# EasyEDA schematic 1 Schematic_Antenna Mini-Whip (TH).json

## Sheets
1 Antenna Mini-Whip (TH): Main module: TITLE: Antenna Mini-Whip (TH): Main module; REV: 4.7.EE; Date: 2018-05-17; Sheet: 1/2; Drawn By: IgrikXD
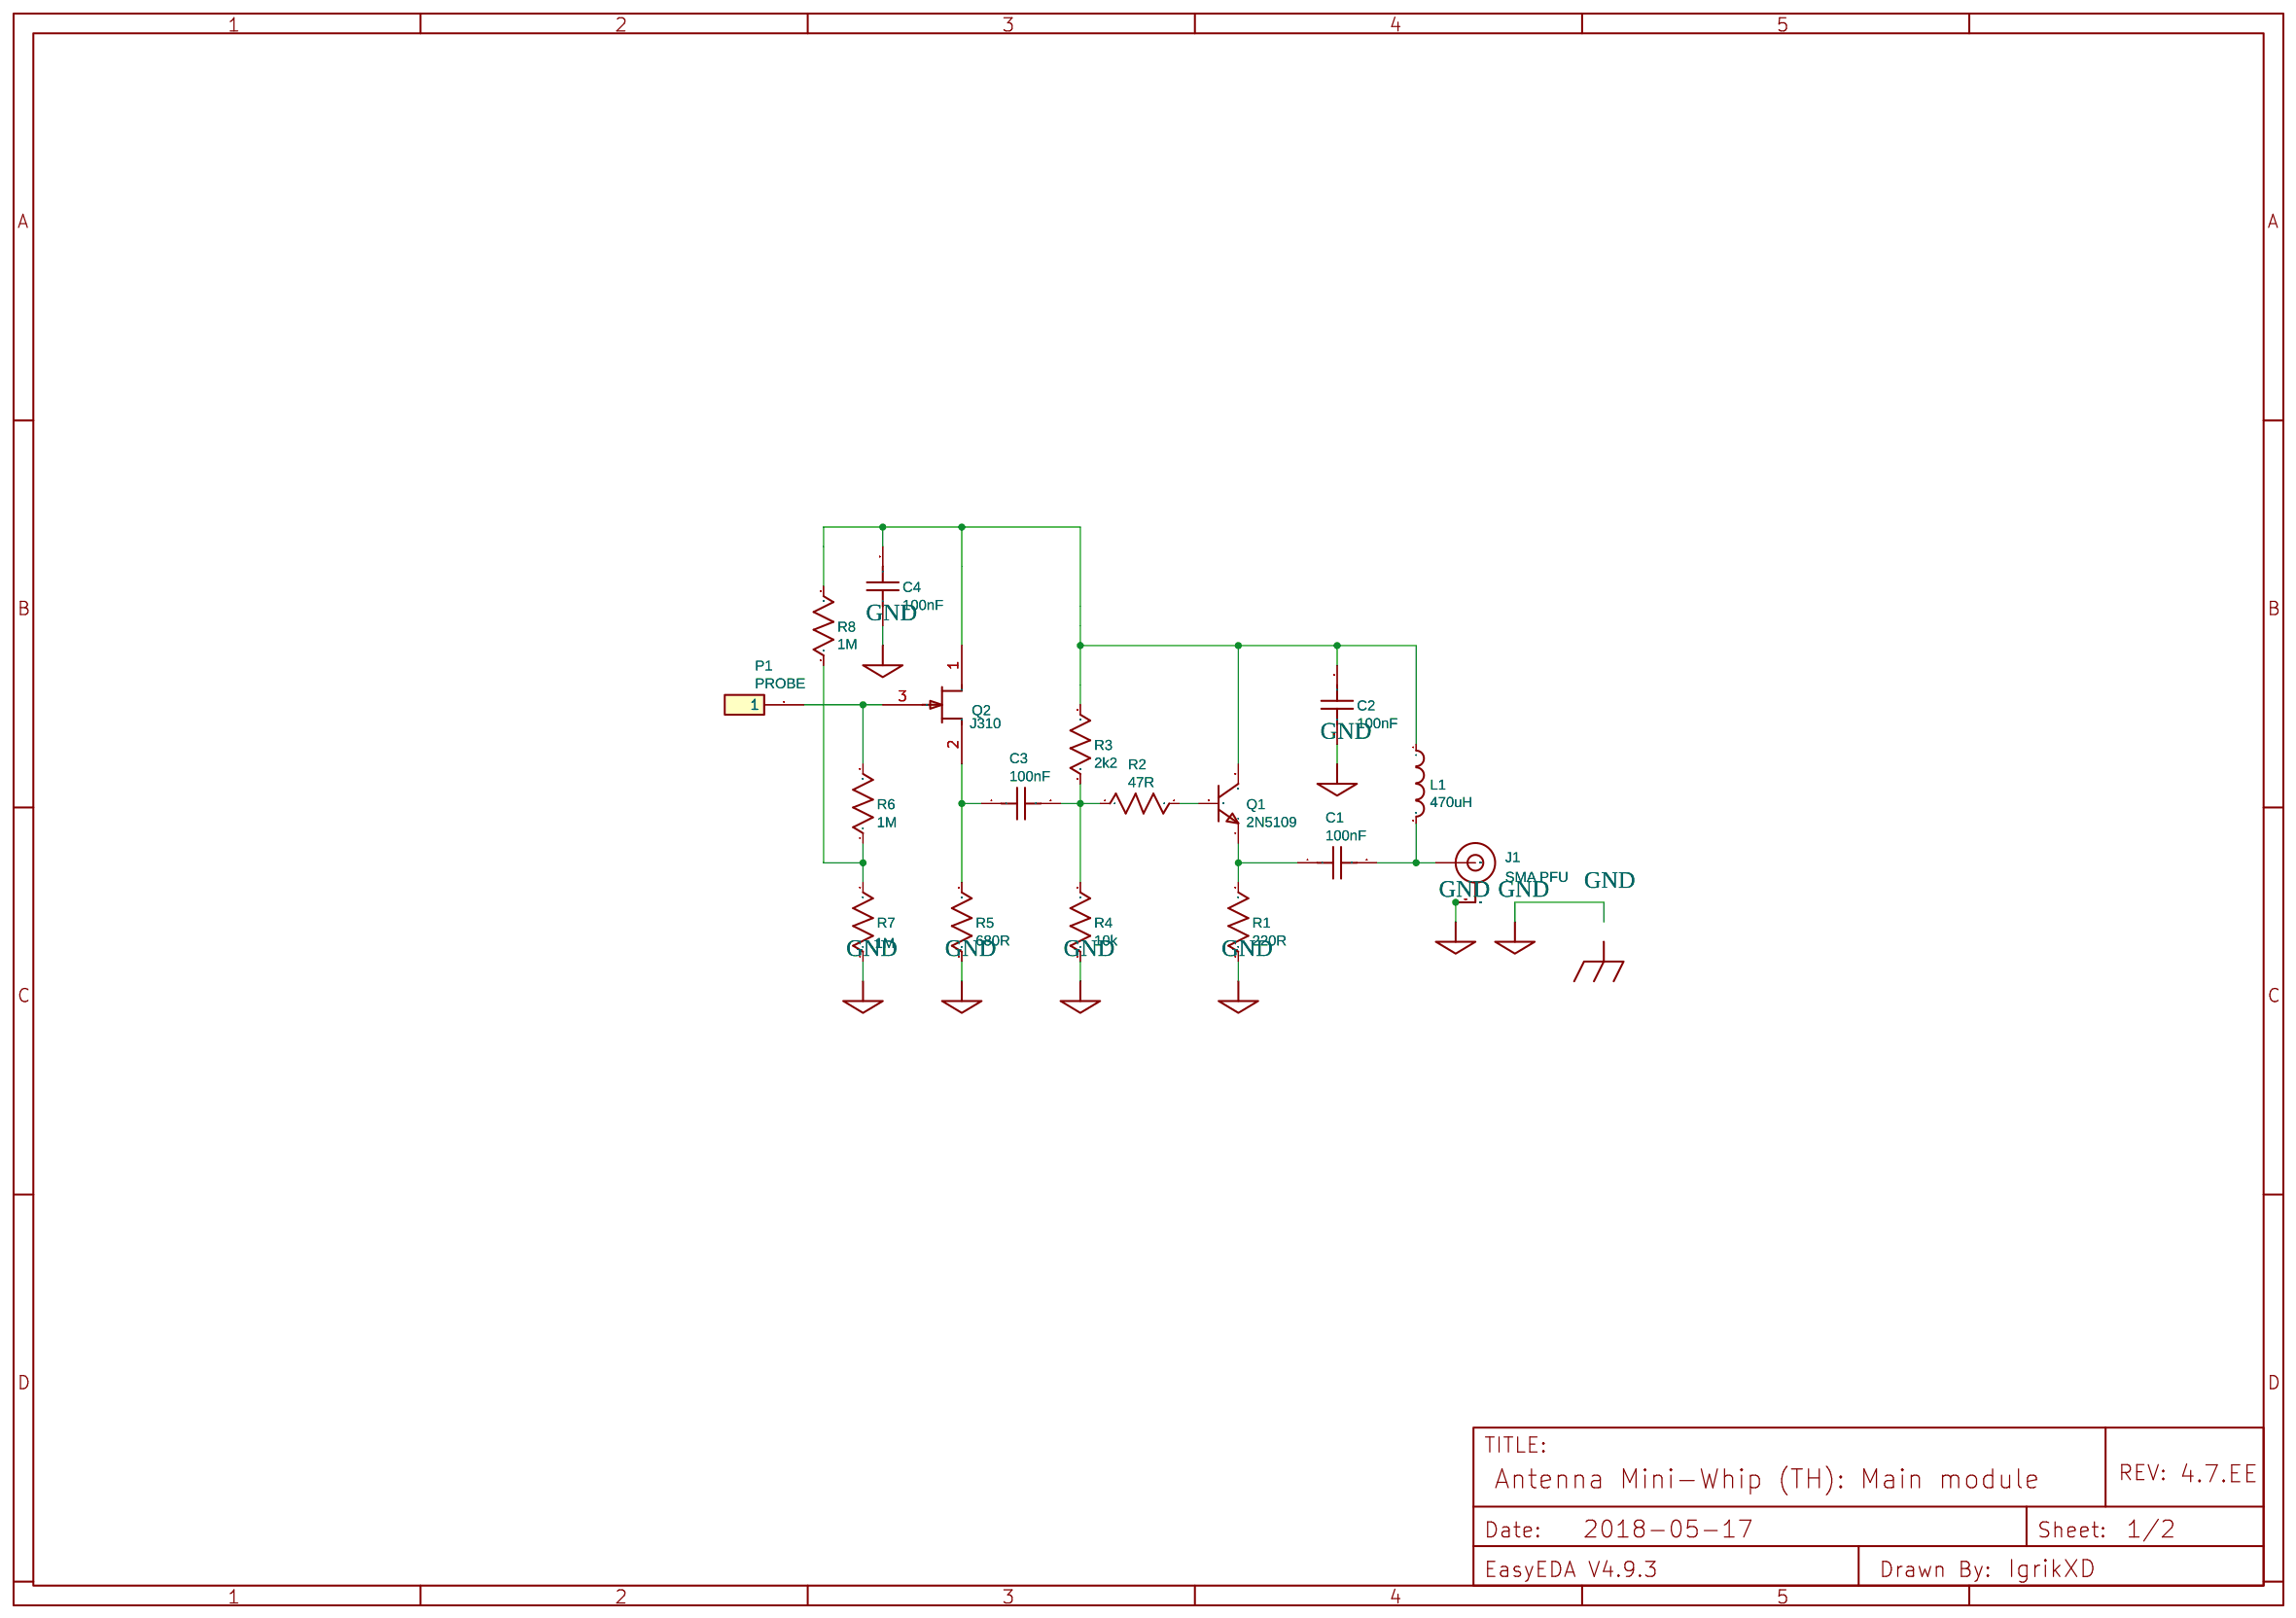
[diagram p0: Antenna Mini-Whip (TH): Main module]
2 Antenna Mini-Whip (TH): Power feed unit: TITLE: Antenna Mini-Whip (TH): Power feed unit; Sheet: 2/2
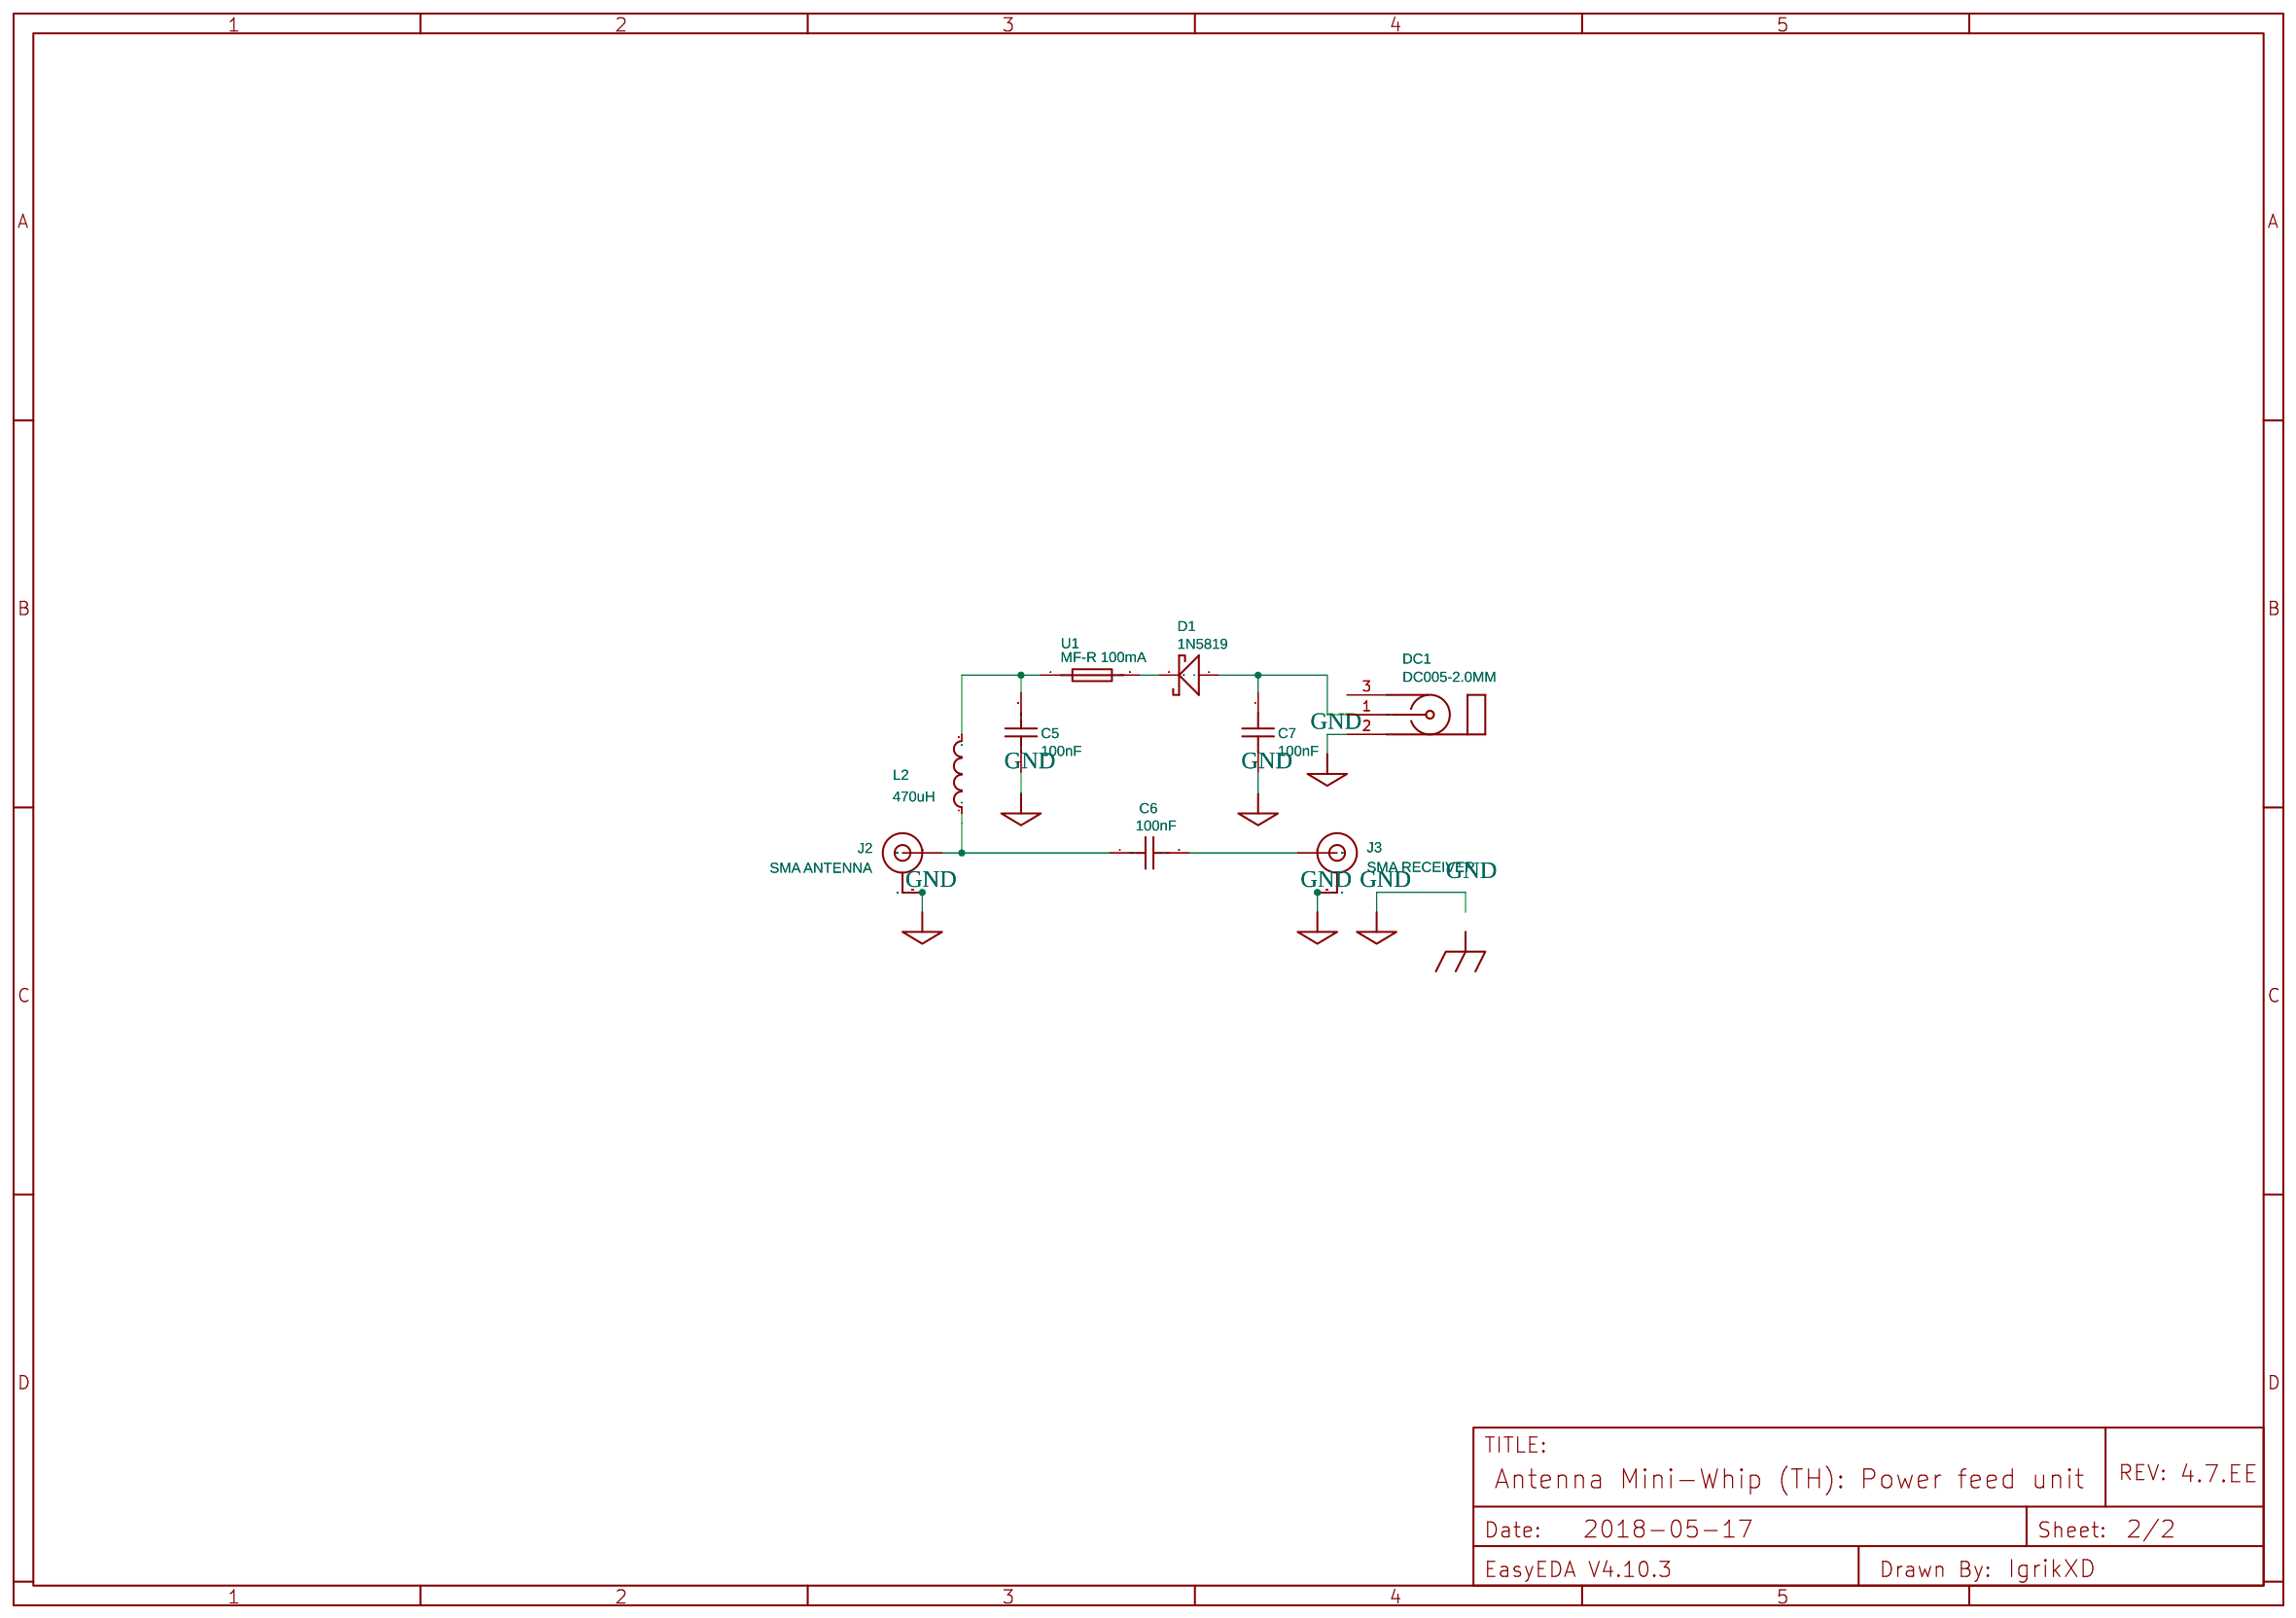
[diagram p1: Antenna Mini-Whip (TH): Power feed unit]

## Parts
sheet Antenna Mini-Whip (TH): Main module
C1  100nF  [RAD-0.1]
C2  100nF  [RAD-0.1]
C3  100nF  [RAD-0.1]
C4  100nF  [RAD-0.1]
J1  SMA PFU  [SMA-EDGE]
L1  470uH  [AXIAL-0.4]
P1  PROBE  [HDR-1X1/2.54]
Q1  2N5109  [TO39]
Q2  J310  [TO92-INLINE]
R1  220R  [AXIAL-0.3]
R2  47R  [AXIAL-0.3]
R3  2k2  [AXIAL-0.3]
R4  10k  [AXIAL-0.3]
R5  680R  [AXIAL-0.3]
R6  1M  [AXIAL-0.3]
R7  1M  [AXIAL-0.3]
R8  1M  [AXIAL-0.3]
sheet Antenna Mini-Whip (TH): Power feed unit
C5  100nF  [RAD-0.1]
C6  100nF  [RAD-0.1]
C7  100nF  [RAD-0.1]
D1  1N5819  [DO41-7]
DC1  DC005-2.0MM  [DC-5020]
J2  SMA ANTENNA  [SMA-EDGE]
J3  SMA RECEIVER  [SMA-EDGE]
L2  470uH  [AXIAL-0.4]
U1  MF-R 100mA  [F-0.10A-60V]

## Library data of the parts
C1-C7 = Capacitor: Manufacturer Part: Monolithic0805B104J500F3; Supplier: LCSC; LCSC: C110282; Manufacturer: FH
J1-J3 = -: SMA Antenna Connector; catid: 20; Contributor: Pinoccio; Manufacturer Part: CON-SMA-EDGE-S; Supplier: Digi-Key; Digi-Key: CON-SMA-EDGE-S-ND; Manufacturer: RF Solutions
L1 L2 = Inductor: Manufacturer Part: LGA0510-471KP52E; Supplier: LCSC; LCSC: C72362; Manufacturer: FH
P1 = -: LCSC: C81276; Supplier: LCSC; Manufacturer: LCSC; Manufacturer Part: Header-Male-2.54_1x1; Mounted: No
Q1 = -: NPN General Purpose Amplifier; catid: 20; Supplier: Digi-Key; Digi-Key: 2N5109CS-ND; Manufacturer: Central Semiconductor Corp
Q2 = -: catid: 20; Supplier: Digi-Key; Manufacturer: ON Semiconductor; Digi-Key: J310-ND
R1 = Resistor: Manufacturer Part: MFR0W4F2200A50; Supplier: LCSC; LCSC: C57439; Manufacturer: UniOhm
R2 = Resistor: Manufacturer Part: MF1/4W-47Ω±1% T52; Supplier: LCSC; LCSC: C119296; Manufacturer: CCO
R3 = Resistor: Manufacturer Part: MFR0W4F2201A50; Supplier: LCSC; LCSC: C58595; Manufacturer: UniOhm
R4 = Resistor: Manufacturer Part: MFR0W4F1002A50; Supplier: LCSC; LCSC: C57436; Manufacturer: UniOhm
R5 = Resistor: Manufacturer Part: MFR0W4F6800A50; Supplier: LCSC; LCSC: C58599; Manufacturer: UniOhm
R6-R8 = Resistor: Manufacturer Part: MFR0W4F1004A50; Supplier: LCSC; LCSC: C58596; Manufacturer: UniOhm
D1 = -: Contributor: IgrikXD; Manufacturer Part: ?
DC1 = -: Supplier: LCSC; Manufacturer: BOOMELE; Manufacturer Part: DC-005 5.5-2.0MM; LCSC: C16214
U1 = -: Supplier: LCSC; Manufacturer: BOURNS; Manufacturer Part: MF-R010; LCSC: C89660; Contributor: IgrikXD

## Nets
GND: C2.1 C4.1 C5.1 C7.1 DC1.2 J1.GND@0(GND) J1.GND@1(GND) J1.GND@2(GND) J1.GND@3(GND) J2.GND@0(GND) J2.GND@1(GND) J2.GND@2(GND) J2.GND@3(GND) J3.GND@0(GND) J3.GND@1(GND) J3.GND@2(GND) J3.GND@3(GND) R1.1 R4.1 R5.1 R7.1
Net-(C1-1): C1.1 Q1.1(E) R1.2
Net-(C1-2): C1.2 J1.SIG(SIGNAL) L1.2
Net-(C2-2): C2.2 C4.2 L1.1 Q1.3(C) Q2.1(D) R3.2 R8.2
Net-(C3-1): C3.1 Q2.2(S) R5.2
Net-(C3-2): C3.2 R2.1 R3.1 R4.2
Net-(C5-2): C5.2 L2.2 U1.1
Net-(C6-1): C6.1 J2.SIG(SIGNAL) L2.1
Net-(C6-2): C6.2 J3.SIG(SIGNAL)
Net-(C7-2): C7.2 D1.A DC1.1(VCC)
Net-(D1-C): D1.C U1.2
Net-(P1-1): P1.1 Q2.3(G) R6.2
Net-(Q1-2): Q1.2(B) R2.2
Net-(R6-1): R6.1 R7.2 R8.1

Not connected (* = marked no-connect by the designer): DC1 3
